# EAGLE design arduino (EAGLE 6.1)

## Sheet 1 of 3
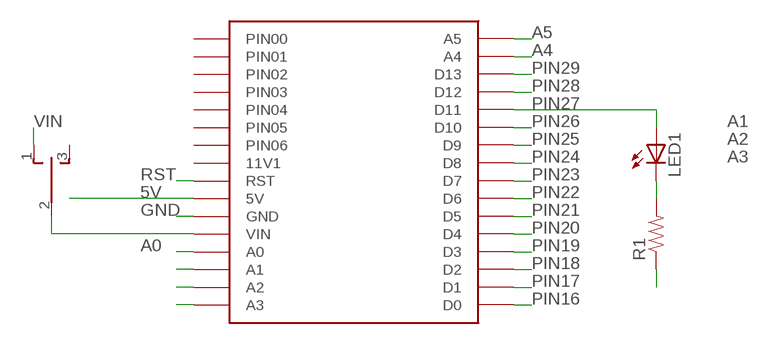
[diagram p0: schematic, sheet 1]

### Parts
LED1  LED3MM  [LED3MM]
R1  RESISTORKIT  [AXIAL-0.3-KIT]
S2  TL39YOSWITCH_2_ESTADOS  [TL3XYO]
U$1  BASE-FINAL  [BASE-FINAL]

### Nets
5V: U$1.5V ; also sheet 2,3
A0: U$1.A0 ; also sheet 2
A1: U$1.A1 ; also sheet 2
A2: U$1.A2 ; also sheet 2
A3: U$1.A3 ; also sheet 2
A4: U$1.A4 ; also sheet 2,3
A5: U$1.A5 ; also sheet 2,3
GND: R1.P$1 U$1.GND ; also sheet 2,3
N$4: S2.2(P) U$1.VIN
N$5: LED1.K(C) R1.P$2
PIN16: U$1.0(D0) ; also sheet 2
PIN17: U$1.1(D1) ; also sheet 2
PIN18: U$1.2(D2) ; also sheet 2
PIN19: U$1.3(D3) ; also sheet 2
PIN20: U$1.4(D4) ; also sheet 2
PIN21: U$1.5(D5) ; also sheet 2
PIN22: U$1.6(D6) ; also sheet 2
PIN23: U$1.7(D7) ; also sheet 2
PIN24: U$1.8(D8) ; also sheet 2
PIN25: U$1.9(D9) ; also sheet 2
PIN26: U$1.10(D10) ; also sheet 2
PIN27: LED1.A U$1.11(D11) ; also sheet 2
PIN28: U$1.12(D12) ; also sheet 2
PIN29: U$1.13(D13) ; also sheet 2
RST: U$1.RST ; also sheet 2
VIN: S2.1(O) ; also sheet 2
Unconnected: S2.3(S) U$1.12V(11V1) U$1.PIN00 U$1.PIN01 U$1.PIN02 U$1.PIN03 U$1.PIN04 U$1.PIN05 U$1.PIN06

## Sheet 2 of 3
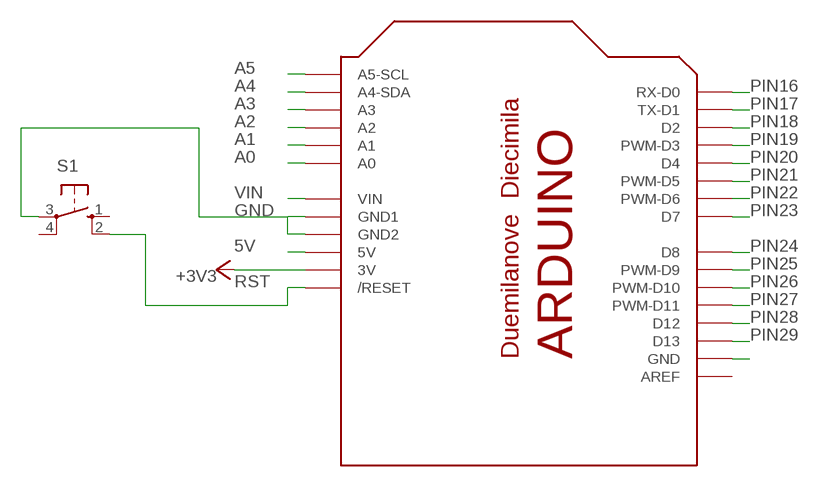
[diagram p1: schematic, sheet 2]

### Parts
S1  10-XX  [B3F-10XX]
U$6  ARDUINO-NOHOLE  [ARDUINO-NOHOLE]

### Nets
5V: U$6.5V ; also sheet 1,3
+3V3: U$6.3V ; also sheet 3
A0: U$6.A0 ; also sheet 1
A1: U$6.A1 ; also sheet 1
A2: U$6.A2 ; also sheet 1
A3: U$6.A3 ; also sheet 1
A4: U$6.A4(A4-SDA) ; also sheet 1,3
A5: U$6.A5(A5-SCL) ; also sheet 1,3
GND: S1.3(P) U$6.GND U$6.GND1 U$6.GND2 ; also sheet 1,3
PIN16: U$6.D0(RX-D0) ; also sheet 1
PIN17: U$6.D1(TX-D1) ; also sheet 1
PIN18: U$6.D2 ; also sheet 1
PIN19: U$6.D3(PWM-D3) ; also sheet 1
PIN20: U$6.D4 ; also sheet 1
PIN21: U$6.D5(PWM-D5) ; also sheet 1
PIN22: U$6.D6(PWM-D6) ; also sheet 1
PIN23: U$6.D7 ; also sheet 1
PIN24: U$6.D8 ; also sheet 1
PIN25: U$6.D9(PWM-D9) ; also sheet 1
PIN26: U$6.D10(PWM-D10) ; also sheet 1
PIN27: U$6.D11(PWM-D11) ; also sheet 1
PIN28: U$6.D12 ; also sheet 1
PIN29: U$6.D13 ; also sheet 1
RST: S1.2(S1) U$6.RESET(/RESET) ; also sheet 1
VIN: U$6.VIN ; also sheet 1
Unconnected: S1.1(S) S1.4(P1) U$6.AREF

## Sheet 3 of 3
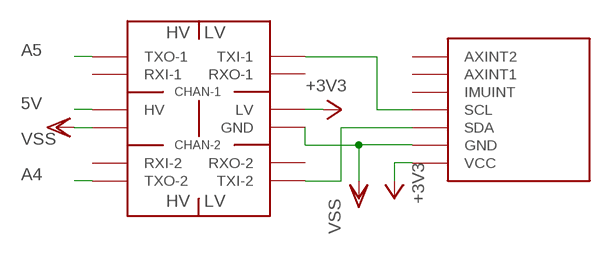
[diagram p2: schematic, sheet 3]

### Parts
U$7  IMU3000COMBO  [IMU3000-COMBO]
U$8  LOGIC-LEVEL-CONVERTER  [LEVEL-CONVERTER]

### Nets
5V: U$8.P$10(HV) ; also sheet 1,2
+3V3: U$7.3V3(VCC) U$8.P$3(LV) ; also sheet 2
A4: U$8.P$7(TXO-2) ; also sheet 1,2
A5: U$8.P$12(TXO-1) ; also sheet 1,2
GND: U$7.VSS(GND) U$8.P$4(GND) U$8.P$9 ; supply symbol labelled VSS ; also sheet 1,2
N$1: U$7.SCL U$8.P$1(TXI-1)
N$2: U$7.SDA U$8.P$6(TXI-2)
Unconnected: U$7.AXINT1 U$7.AXINT2 U$7.IMUINT U$8.P$2(RXO-1) U$8.P$5(RXO-2) U$8.P$8(RXI-2) U$8.P$11(RXI-1)

## Library data of the parts
LED1 = SparkFun:LED: LEDs Standard schematic elements and footprints for 5mm, 3mm, 1206, and 0603 sized LEDs. 5mm - Spark Fun Electronics SKU : COM-00529 (and others)
R1 = SparkFun:RESISTOR: Resistor Basic schematic elements and footprints for 0603, 1206, and PTH resistors.
S1 = switch-omron:10-XX: OMRON SWITCH; MPN: B3F-1000; OC_FARNELL: 176432; OC_NEWARK: 36M3542
S2 = aasanchez:TL39YO: TINY SWITCH ON OFF ON Source: http://www2.produktinfo.conrad.com/datenblaetter/700000-724999/705152-da-01-de-Subminiaturschalter_TL_36YO.pdf
U$1 = aasanchez:BASE-FINAL
U$6 = adafruit:ARDUINO: Arduino Diecimila/Duemilanove Make a shield with ease, this package has all the named pins as well as the two mounting drill holes and an outline of the USB and DC power connector. The outline is on the DIMENSION layer, so if your board house uses it they will cut the outline to match. http://www.ladyada.net/library/pcb/eaglelibrary.html
U$7 = aasanchez:IMU3000COMBO
U$8 = aasanchez:LOGIC-LEVEL-CONVERTER

## Board
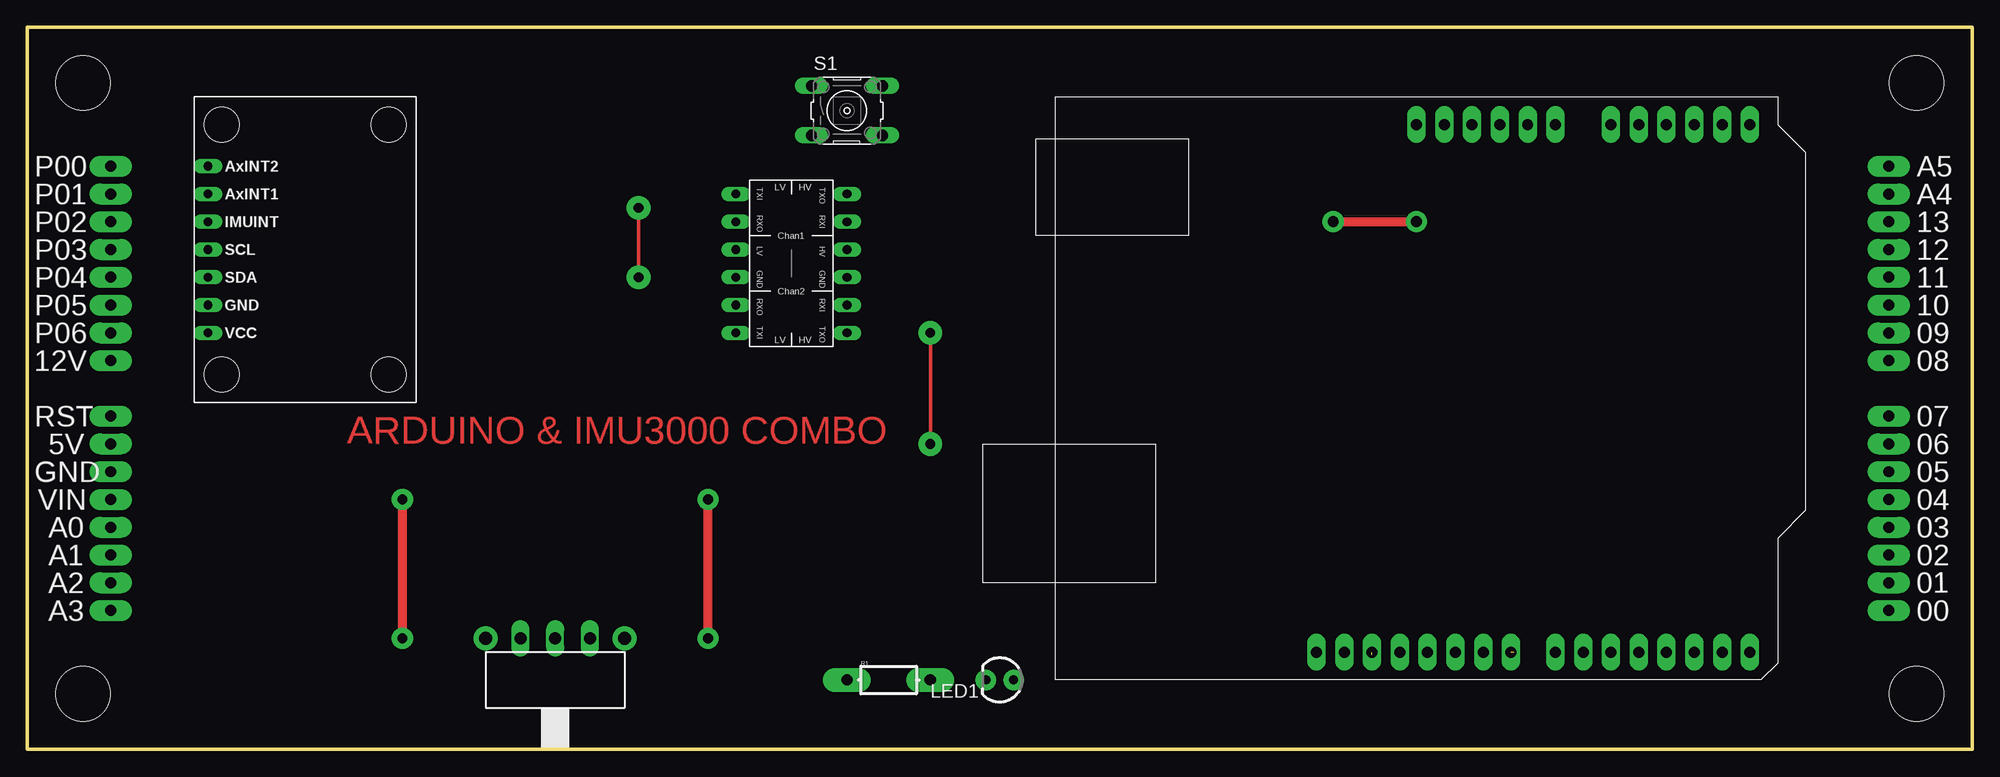
[diagram p3: board, top side]
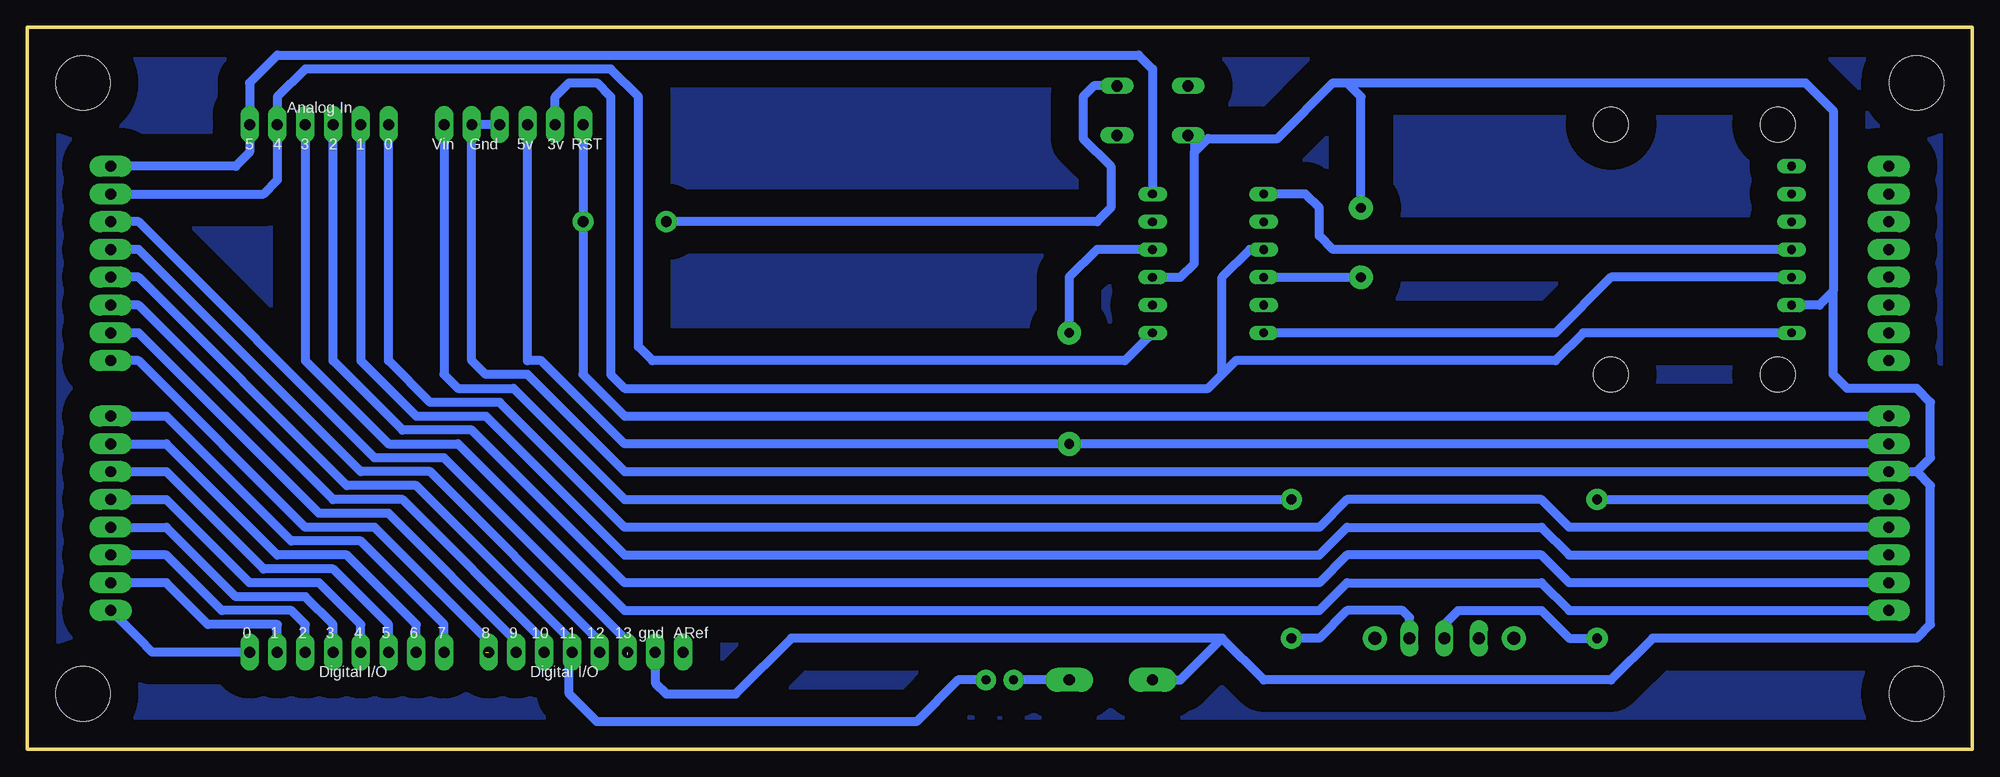
[diagram p4: board, bottom side, seen from below]

Size 177.8 x 66.04 mm. Coordinates in mm from the lower left corner, seen from the top.
Copper layers (1*16): Top 0.035mm / dielectric 1.5mm / Bottom 0.035mm
Design rules: minimum track width 10mil, minimum drill 24mil, track to track 8mil, track to pad 8mil, pad to pad 8mil, via to via 8mil, smd to smd 8mil, copper to edge 20mil, drill to drill 8mil, minimum pad ring 10mil, minimum via ring 8mil, stop-mask expansion 4mil, vias tented up to drill 0mil, thermal gap 10mil

### Footprints (pad centres in the part's own frame; a part is rotated, then mirrored left to right if it is on the bottom)
LED3MM = drill 0.813 pad 1.88: A -1.27,0; K 1.27,0
AXIAL-0.3-KIT = drill 1.016 pad 2.184 long: P$1 -3.81,0; P$2 3.81,0
B3F-10XX = drill 1.016 long: 1 -3.251,2.261; 2 3.251,2.261; 3 -3.251,-2.261; 4 3.251,-2.261
TL3XYO = drill 1.1 pad 1.422 long: 1 -3.175,-3.81; 2 0,-3.81; 3 3.175,-3.81 | drill 1.2 pad 2.184: M1 -6.35,-3.81; M2 6.35,-3.81
BASE-FINAL = drill 1 pad 1.93 long: 0 81.28,-20.32; 1 81.28,-17.78; 2 81.28,-15.24; 3 81.28,-12.7; 4 81.28,-10.16; 5 81.28,-7.62; 5V -81.28,-5.08; 6 81.28,-5.08; 7 81.28,-2.54; 8 81.28,2.54; 9 81.28,5.08; 10 81.28,7.62; 11 81.28,10.16; 12 81.28,12.7; 12V -81.28,2.54; 13 81.28,15.24; A0 -81.28,-12.7; A1 -81.28,-15.24; A2 -81.28,-17.78; A3 -81.28,-20.32; A4 81.28,17.78; A5 81.28,20.32; GND -81.28,-7.62; PIN00 -81.28,20.32; PIN01 -81.28,17.78; PIN02 -81.28,15.24; PIN03 -81.28,12.7; PIN04 -81.28,10.16; PIN05 -81.28,7.62; PIN06 -81.28,5.08; RST -81.28,-2.54; VIN -81.28,-10.16 | hole 5: -83.82,27.94; -83.82,-27.94; 83.82,-27.94; 83.82,27.94
ARDUINO-NOHOLE = drill 1 pad 1.676 long: 3V 35.56,2.54; 5V 38.1,2.54; A0 50.8,2.54; A1 53.34,2.54; A2 55.88,2.54; A3 58.42,2.54; A4 60.96,2.54; A5 63.5,2.54; AREF 23.876,50.8; D0 63.5,50.8; D1 60.96,50.8; D2 58.42,50.8; D3 55.88,50.8; D4 53.34,50.8; D5 50.8,50.8; D6 48.26,50.8; D7 45.72,50.8; D8 41.656,50.8; D9 39.116,50.8; D10 36.576,50.8; D11 34.036,50.8; D12 31.496,50.8; D13 28.956,50.8; GND 26.416,50.8; GND1 43.18,2.54; GND2 40.64,2.54; RESET 33.02,2.54; VIN 45.72,2.54
IMU3000-COMBO = drill 0.8 long: 3V3 1.27,6.35; AXINT1 1.27,19.05; AXINT2 1.27,21.59; IMUINT 1.27,16.51; SCL 1.27,13.97; SDA 1.27,11.43; VSS 1.27,8.89 | hole 3.2: 2.54,25.4; 17.78,25.4; 17.78,2.54; 2.54,2.54
LEVEL-CONVERTER = drill 0.8 long: P$1 -1.27,13.97; P$2 -1.27,11.43; P$3 -1.27,8.89; P$4 -1.27,6.35; P$5 -1.27,3.81; P$6 -1.27,1.27; P$7 8.89,1.27; P$8 8.89,3.81; P$9 8.89,6.35; P$10 8.89,8.89; P$11 8.89,11.43; P$12 8.89,13.97

### Placement (x,y rotation side)
LED1  88.9,6.35 180 top
R1  78.74,6.35 0 top
S1  74.93,58.42 0 top
S2  48.26,6.35 180 top
U$1  88.9,33.02 0 top
U$6  93.98,59.69 180 bottom
U$7  15.24,31.75 0 top
U$8  66.04,36.83 0 top

### Tracks (layer width: path | path; a pad name or v marks a point on that pad's centre or on a via)
5V  (via drill 0.9 pad 2.18)
  Top 0.305: v82.55,38.1 v82.55,27.94
  Bottom 0.813: U$1.5V v82.55,27.94 123.19,27.94 130.81,35.56 132.08,35.56 U$6.5V | U$8.P$10 80.01,45.72 82.55,43.18 v82.55,38.1
+3V3
  Bottom 0.813: U$7.3V3 35.56,38.1 38.1,35.56 67.31,35.56 68.58,34.29 | U$6.3V 129.54,59.69 128.27,60.96 125.73,60.96 124.46,59.69 124.46,34.29 123.19,33.02 69.85,33.02 68.58,34.29 | 68.58,34.29 68.58,43.18 66.04,45.72 U$8.P$3
A0
  Bottom 0.813: U$6.A0 144.78,35.56 140.97,31.75 134.62,31.75 123.19,20.32 59.69,20.32 57.15,22.86 39.37,22.86 36.83,20.32 U$1.A0
A1
  Bottom 0.813: U$6.A1 147.32,35.56 142.24,30.48 135.89,30.48 123.19,17.78 59.69,17.78 57.15,20.32 39.37,20.32 36.83,17.78 U$1.A1
A2
  Bottom 0.813: U$6.A2 149.86,35.56 143.51,29.21 137.16,29.21 123.19,15.24 59.69,15.24 57.15,17.78 39.37,17.78 36.83,15.24 U$1.A2
A3
  Bottom 0.813: U$6.A3 152.4,35.56 144.78,27.94 138.43,27.94 123.19,12.7 59.69,12.7 57.15,15.24 39.37,15.24 36.83,12.7 U$1.A3
A4
  Bottom 0.813: U$1.A4 156.21,50.8 154.94,52.07 U$6.A4 154.94,59.69 152.4,62.23 124.46,62.23 121.92,59.69 121.92,36.83 120.65,35.56 77.47,35.56 U$8.P$7
A5
  Bottom 0.813: U$1.A5 158.75,53.34 157.48,54.61 U$6.A5 157.48,60.96 154.94,63.5 76.2,63.5 74.93,62.23 U$8.P$12
GND  (via drill 0.9 pad 2.18)
  Top 0.305: v55.88,43.18 v55.88,49.53
  Bottom 0.813: U$6.GND2 U$6.GND1 137.16,35.56 135.89,34.29 132.08,34.29 123.19,25.4 U$1.GND 5.08,25.4 | 57.15,60.96 58.42,60.96 63.5,55.88 69.85,55.88 71.12,54.61 | 57.15,60.96 15.24,60.96 12.7,58.42 12.7,41.91 | 12.7,41.91 13.97,40.64 U$7.VSS | U$6.GND 120.4,6.1 119.38,5.08 113.03,5.08 107.95,10.16 68.58,10.16 | 5.08,25.4 3.81,24.13 3.81,11.43 5.08,10.16 29.21,10.16 33.02,6.35 64.77,6.35 68.58,10.16 | U$8.P$9 72.39,43.18 71.12,44.45 71.12,54.61 | S1.3 71.12,56.16 71.12,54.61 | 5.08,25.4 3.81,26.67 3.81,31.75 5.08,33.02 11.43,33.02 12.7,34.29 12.7,41.91 | v55.88,49.53 55.88,59.69 57.15,60.96 | U$8.P$4 v55.88,43.18 | R1.P$1 72.39,6.35 68.58,10.16
N$1
  Bottom 0.813: U$7.SCL 58.42,45.72 59.69,46.99 59.69,49.53 60.96,50.8 U$8.P$1
N$2
  Bottom 0.813: U$7.SDA 33.02,43.18 38.1,38.1 U$8.P$6
N$3
  pour Bottom (isolate 2.54): 0,0 177.8,0 177.8,66.04 0,66.04 0,1.27
N$4  (via drill 0.9 pad 1.93)
  Top 0.813: v34.29,10.16 v34.29,22.86
  Bottom 0.813: S2.2 48.26,11.43 46.99,12.7 39.37,12.7 36.83,10.16 v34.29,10.16 | v34.29,22.86 U$1.VIN
N$5
  Bottom 0.813: R1.P$2 LED1.K
PIN16
  Bottom 0.813: U$6.D0 166.37,8.89 167.64,10.16 U$1.0
PIN17
  Bottom 0.813: U$1.1 165.1,15.24 161.29,11.43 154.94,11.43 U$6.D1
PIN18
  Bottom 0.813: U$6.D2 152.4,11.43 153.67,12.7 160.02,12.7 165.1,17.78 U$1.2
PIN19
  Bottom 0.813: U$6.D3 149.86,11.43 152.4,13.97 158.75,13.97 165.1,20.32 U$1.3
PIN20
  Bottom 0.813: U$6.D4 147.32,11.43 151.13,15.24 157.48,15.24 165.1,22.86 U$1.4
PIN21
  Bottom 0.813: U$6.D5 144.78,11.43 149.86,16.51 156.21,16.51 165.1,25.4 U$1.5
PIN22
  Bottom 0.813: U$6.D6 142.24,11.43 148.59,17.78 154.94,17.78 165.1,27.94 U$1.6
PIN23
  Bottom 0.813: U$6.D7 139.7,11.43 147.32,19.05 153.67,19.05 165.1,30.48 U$1.7
PIN24  (1 unrouted)
  Bottom 0.813: U$1.8 167.64,35.56 152.4,20.32 146.05,20.32 135.89,10.16 135.89,8.89
PIN25
  Bottom 0.813: 133.1,8.64 U$6.D9 133.1,9.91 144.78,21.59 151.13,21.59 167.64,38.1 U$1.9
PIN26
  Bottom 0.813: 130.56,8.64 U$6.D10 130.56,9.91 143.51,22.86 149.86,22.86 167.64,40.64 U$1.10
PIN27
  Bottom 0.813: U$6.D11 128.02,8.64 | U$1.11 167.64,43.18 148.59,24.13 142.24,24.13 128.02,9.91 U$6.D11 | LED1.A 92.71,6.35 96.52,2.54 125.73,2.54 128.27,5.08 128.27,8.64 U$6.D11
PIN28
  Bottom 0.813: 125.48,8.64 U$6.D12 125.48,9.91 140.97,25.4 147.32,25.4 167.64,45.72 U$1.12
PIN29  (1 unrouted)
  Bottom 0.813: U$1.13 167.64,48.26 146.05,26.67 139.7,26.67 122.94,9.91 122.94,8.64
RST  (via drill 1 pad 1.93)
  Top 0.813: v119.38,48.26 v127,48.26
  Bottom 0.813: U$6.RESET v127,48.26 127,34.29 123.19,30.48 U$1.RST | v119.38,48.26 80.01,48.26 78.74,49.53 78.74,53.34 81.28,55.88 81.28,59.69 80.29,60.68 S1.2
VIN  (via drill 0.9 pad 1.93)
  Top 0.813: v62.23,10.16 v62.23,22.86
  Bottom 0.813: U$6.VIN 139.7,34.29 138.43,33.02 133.35,33.02 123.19,22.86 v62.23,22.86 | S2.1 51.44,12.07 52.07,12.7 57.15,12.7 59.69,10.16 v62.23,10.16

### Text on the board
Top: ARDUINO & IMU3000 COMBO